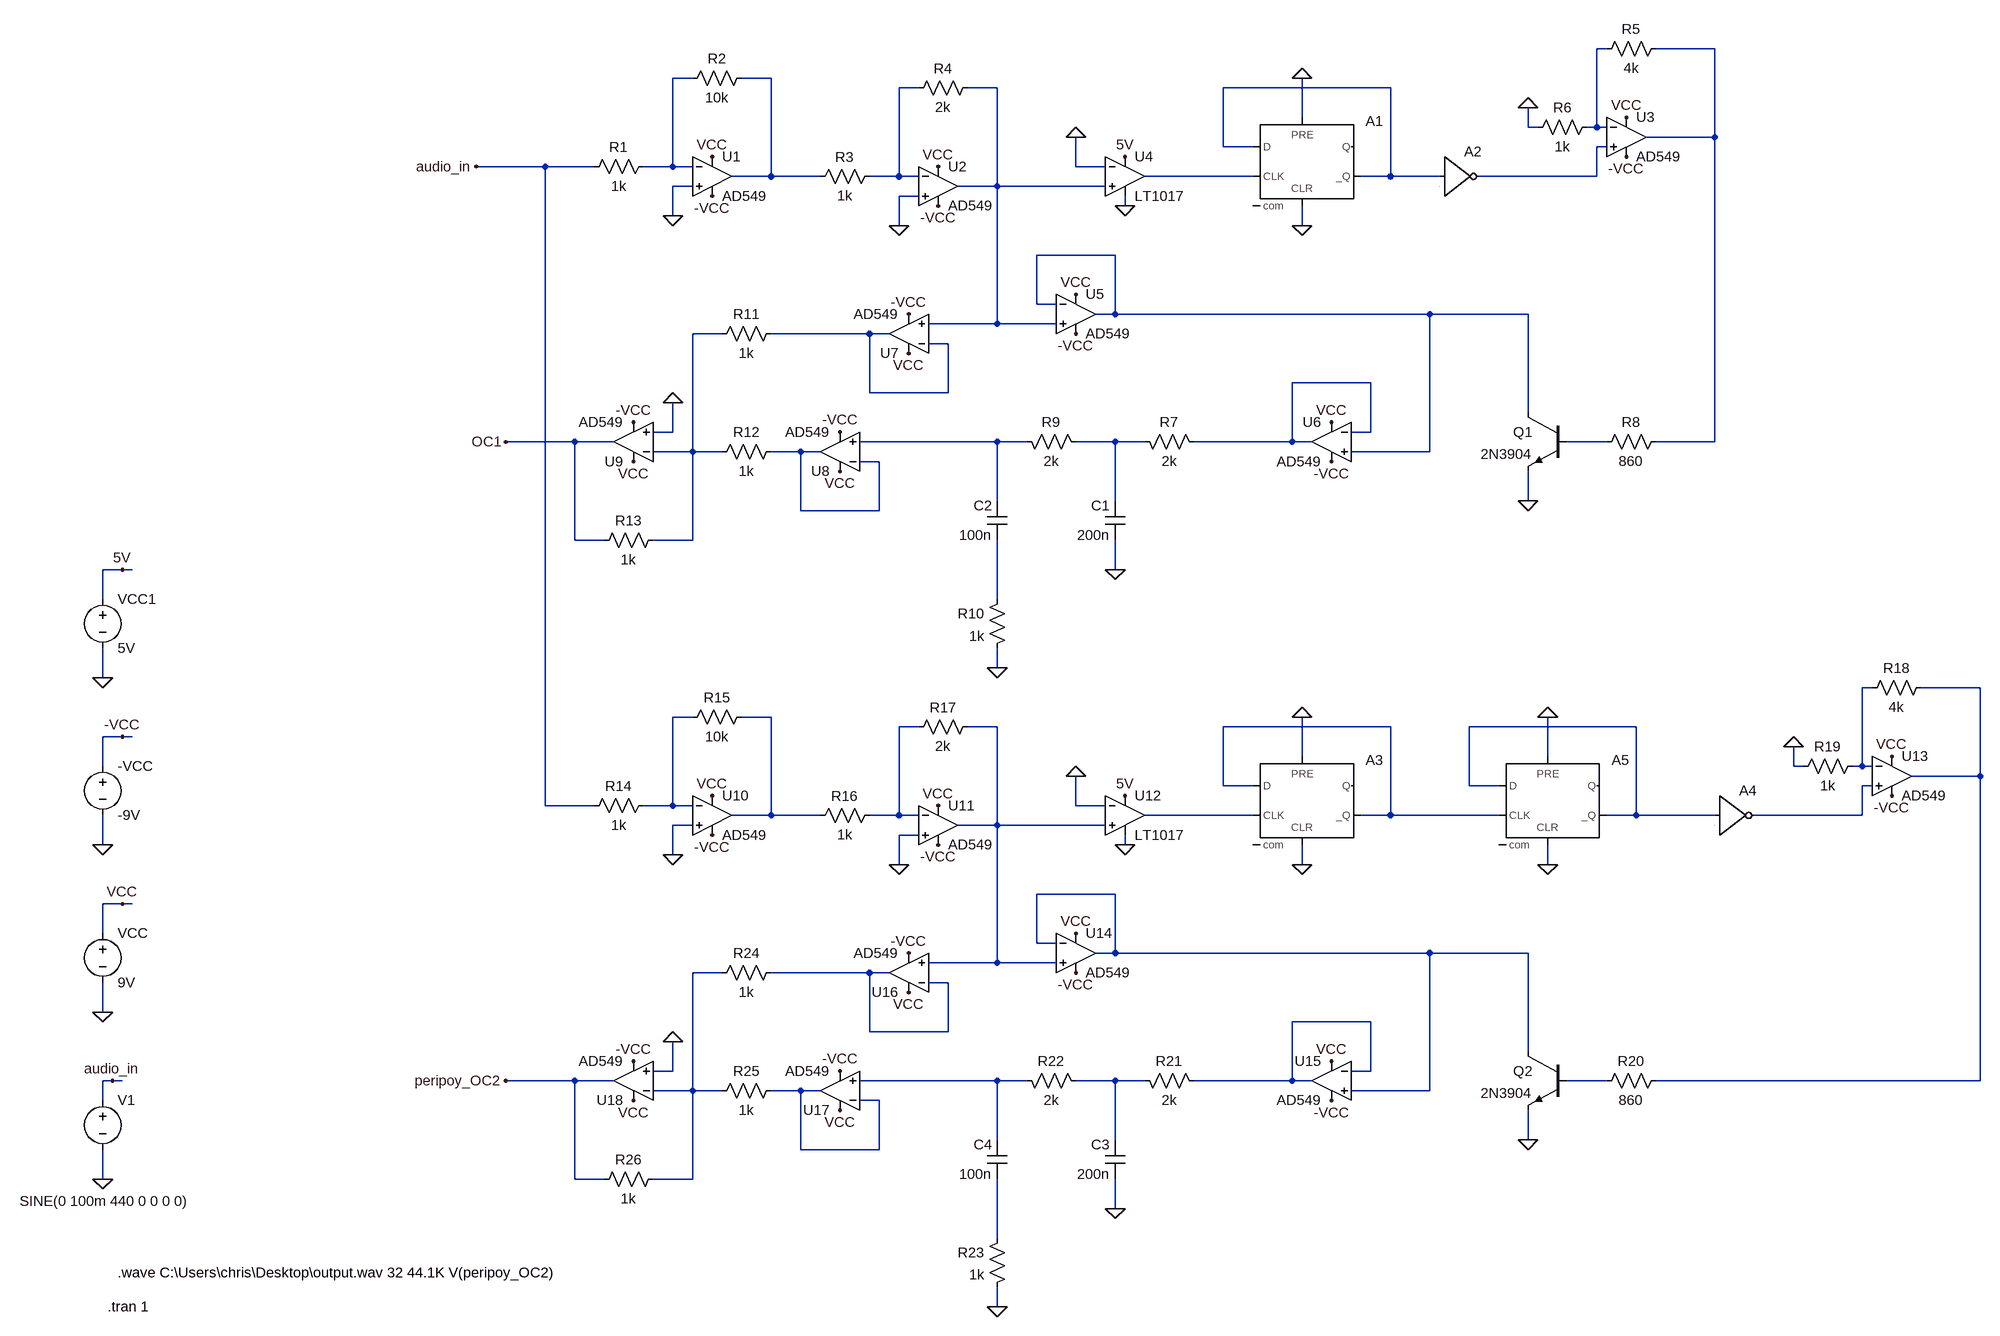
[diagram p0: schematic octaver.asc]
octaver.asc, the LTspice schematic file:
Version 4
SHEET 1 3124 1348
WIRE 2080 -720 2064 -720
WIRE 2256 -720 2160 -720
WIRE 592 -672 560 -672
WIRE 720 -672 672 -672
WIRE 960 -656 928 -656
WIRE 1088 -656 1040 -656
WIRE 1728 -656 1456 -656
WIRE 1584 -608 1584 -672
WIRE 1952 -592 1952 -624
WIRE 1968 -592 1952 -592
WIRE 2064 -592 2064 -720
WIRE 2064 -592 2048 -592
WIRE 2080 -592 2064 -592
WIRE 2256 -576 2256 -720
WIRE 2256 -576 2144 -576
WIRE 1456 -560 1456 -656
WIRE 1504 -560 1456 -560
WIRE 2080 -560 2064 -560
WIRE 352 -528 240 -528
WIRE 432 -528 352 -528
WIRE 560 -528 560 -672
WIRE 560 -528 512 -528
WIRE 592 -528 560 -528
WIRE 1216 -528 1216 -576
WIRE 1264 -528 1216 -528
WIRE 720 -512 720 -672
WIRE 720 -512 656 -512
WIRE 800 -512 720 -512
WIRE 928 -512 928 -656
WIRE 928 -512 880 -512
WIRE 960 -512 928 -512
WIRE 1504 -512 1328 -512
WIRE 1728 -512 1728 -656
WIRE 1728 -512 1680 -512
WIRE 1808 -512 1728 -512
WIRE 2064 -512 2064 -560
WIRE 2064 -512 1872 -512
WIRE 592 -496 560 -496
WIRE 1088 -496 1088 -656
WIRE 1088 -496 1024 -496
WIRE 1264 -496 1088 -496
WIRE 960 -480 928 -480
WIRE 1296 -464 1296 -480
WIRE 560 -448 560 -496
WIRE 928 -432 928 -480
WIRE 1584 -432 1584 -464
WIRE 1280 -384 1152 -384
WIRE 1152 -304 1152 -384
WIRE 1184 -304 1152 -304
WIRE 1280 -288 1280 -384
WIRE 1280 -288 1248 -288
WIRE 1792 -288 1280 -288
WIRE 1952 -288 1792 -288
WIRE 1088 -272 1088 -496
WIRE 1088 -272 976 -272
WIRE 1184 -272 1088 -272
WIRE 640 -256 592 -256
WIRE 880 -256 720 -256
WIRE 912 -256 880 -256
WIRE 1008 -240 976 -240
WIRE 1696 -176 1568 -176
WIRE 880 -160 880 -256
WIRE 1008 -160 1008 -240
WIRE 1008 -160 880 -160
WIRE 1952 -128 1952 -288
WIRE 560 -96 560 -144
WIRE 560 -96 528 -96
WIRE 1696 -96 1696 -176
WIRE 1696 -96 1664 -96
WIRE 400 -80 288 -80
WIRE 464 -80 400 -80
WIRE 1088 -80 864 -80
WIRE 1136 -80 1088 -80
WIRE 1280 -80 1216 -80
WIRE 1328 -80 1280 -80
WIRE 1568 -80 1568 -176
WIRE 1568 -80 1408 -80
WIRE 1600 -80 1568 -80
WIRE 2080 -80 2016 -80
WIRE 2256 -80 2256 -576
WIRE 2256 -80 2160 -80
WIRE 592 -64 592 -256
WIRE 592 -64 528 -64
WIRE 640 -64 592 -64
WIRE 768 -64 720 -64
WIRE 800 -64 768 -64
WIRE 1792 -64 1792 -288
WIRE 1792 -64 1664 -64
WIRE 896 -48 864 -48
WIRE 1088 16 1088 -80
WIRE 1280 16 1280 -80
WIRE 1952 16 1952 -32
WIRE 768 32 768 -64
WIRE 896 32 896 -48
WIRE 896 32 768 32
WIRE 400 80 400 -80
WIRE 448 80 400 80
WIRE 592 80 592 -64
WIRE 592 80 528 80
WIRE -336 128 -368 128
WIRE -320 128 -336 128
WIRE 1280 128 1280 80
WIRE -368 176 -368 128
WIRE 1088 176 1088 80
WIRE 1088 288 1088 256
WIRE -368 304 -368 256
WIRE 2512 320 2496 320
WIRE 2688 320 2592 320
WIRE 592 368 560 368
WIRE 720 368 672 368
WIRE 960 384 928 384
WIRE 1088 384 1040 384
WIRE 1728 384 1456 384
WIRE 2128 384 1856 384
WIRE -336 400 -368 400
WIRE -320 400 -336 400
WIRE 1584 432 1584 368
WIRE 1984 432 1984 368
WIRE -368 448 -368 400
WIRE 2384 448 2384 416
WIRE 2400 448 2384 448
WIRE 2496 448 2496 320
WIRE 2496 448 2480 448
WIRE 2512 448 2496 448
WIRE 2688 464 2688 320
WIRE 2688 464 2576 464
WIRE 1456 480 1456 384
WIRE 1504 480 1456 480
WIRE 1856 480 1856 384
WIRE 1904 480 1856 480
WIRE 2512 480 2496 480
WIRE 352 512 352 -528
WIRE 432 512 352 512
WIRE 560 512 560 368
WIRE 560 512 512 512
WIRE 592 512 560 512
WIRE 1216 512 1216 464
WIRE 1264 512 1216 512
WIRE 720 528 720 368
WIRE 720 528 656 528
WIRE 800 528 720 528
WIRE 928 528 928 384
WIRE 928 528 880 528
WIRE 960 528 928 528
WIRE 1504 528 1328 528
WIRE 1728 528 1728 384
WIRE 1728 528 1680 528
WIRE 1904 528 1728 528
WIRE 2128 528 2128 384
WIRE 2128 528 2080 528
WIRE 2256 528 2128 528
WIRE 2496 528 2496 480
WIRE 2496 528 2320 528
WIRE 592 544 560 544
WIRE 1088 544 1088 384
WIRE 1088 544 1024 544
WIRE 1264 544 1088 544
WIRE 960 560 928 560
WIRE -368 576 -368 528
WIRE 1296 576 1296 560
WIRE 560 592 560 544
WIRE 928 608 928 560
WIRE 1584 608 1584 576
WIRE 1984 608 1984 576
WIRE 1280 656 1152 656
WIRE -336 672 -368 672
WIRE -320 672 -336 672
WIRE -368 720 -368 672
WIRE 1152 736 1152 656
WIRE 1184 736 1152 736
WIRE 1280 752 1280 656
WIRE 1280 752 1248 752
WIRE 1792 752 1280 752
WIRE 1952 752 1792 752
WIRE 1088 768 1088 544
WIRE 1088 768 976 768
WIRE 1184 768 1088 768
WIRE 640 784 592 784
WIRE 880 784 720 784
WIRE 912 784 880 784
WIRE 1008 800 976 800
WIRE -368 848 -368 800
WIRE 1696 864 1568 864
WIRE 880 880 880 784
WIRE 1008 880 1008 800
WIRE 1008 880 880 880
WIRE 1952 912 1952 752
WIRE 560 944 560 896
WIRE 560 944 528 944
WIRE 1696 944 1696 864
WIRE 1696 944 1664 944
WIRE -352 960 -368 960
WIRE -336 960 -352 960
WIRE 400 960 288 960
WIRE 464 960 400 960
WIRE 1088 960 864 960
WIRE 1136 960 1088 960
WIRE 1280 960 1216 960
WIRE 1328 960 1280 960
WIRE 1568 960 1568 864
WIRE 1568 960 1408 960
WIRE 1600 960 1568 960
WIRE 2080 960 2016 960
WIRE 2688 960 2688 464
WIRE 2688 960 2160 960
WIRE 592 976 592 784
WIRE 592 976 528 976
WIRE 640 976 592 976
WIRE 768 976 720 976
WIRE 800 976 768 976
WIRE 1792 976 1792 752
WIRE 1792 976 1664 976
WIRE -368 992 -368 960
WIRE 896 992 864 992
WIRE 1088 1056 1088 960
WIRE 1280 1056 1280 960
WIRE 1952 1056 1952 1008
WIRE 768 1072 768 976
WIRE 896 1072 896 992
WIRE 896 1072 768 1072
WIRE -368 1120 -368 1072
WIRE 400 1120 400 960
WIRE 448 1120 400 1120
WIRE 592 1120 592 976
WIRE 592 1120 528 1120
WIRE 1280 1168 1280 1120
WIRE 1088 1216 1088 1120
WIRE 1088 1328 1088 1296
FLAG -368 1120 0
FLAG -352 960 audio_in
FLAG -368 848 0
FLAG -368 576 0
FLAG -336 672 VCC
FLAG -336 400 -VCC
FLAG 624 -544 VCC
FLAG 624 -480 -VCC
FLAG 560 -448 0
FLAG 240 -528 audio_in
FLAG 992 -528 VCC
FLAG 992 -464 -VCC
FLAG 928 -432 0
FLAG -368 304 0
FLAG -336 128 5V
FLAG 1296 -464 0
FLAG 1216 -576 0
FLAG 1296 -544 5V
FLAG 1584 -432 0
FLAG 1584 -672 0
FLAG 2112 -608 VCC
FLAG 2112 -544 -VCC
FLAG 1952 -624 0
FLAG 1216 -320 VCC
FLAG 1216 -256 -VCC
FLAG 1952 16 0
FLAG 1632 -112 VCC
FLAG 1632 -48 -VCC
FLAG 1280 128 0
FLAG 1088 288 0
FLAG 944 -224 VCC
FLAG 944 -288 -VCC
FLAG 832 -32 VCC
FLAG 832 -96 -VCC
FLAG 496 -48 VCC
FLAG 496 -112 -VCC
FLAG 560 -144 0
FLAG 288 -80 OC1
FLAG 992 512 VCC
FLAG 992 576 -VCC
FLAG 928 608 0
FLAG 1296 576 0
FLAG 1216 464 0
FLAG 1296 496 5V
FLAG 1584 608 0
FLAG 1584 368 0
FLAG 2544 432 VCC
FLAG 2544 496 -VCC
FLAG 2384 416 0
FLAG 1216 720 VCC
FLAG 1216 784 -VCC
FLAG 1952 1056 0
FLAG 1632 928 VCC
FLAG 1632 992 -VCC
FLAG 1280 1168 0
FLAG 1088 1328 0
FLAG 944 816 VCC
FLAG 944 752 -VCC
FLAG 832 1008 VCC
FLAG 832 944 -VCC
FLAG 496 992 VCC
FLAG 496 928 -VCC
FLAG 560 896 0
FLAG 288 960 peripoy_OC2
FLAG 624 496 VCC
FLAG 624 560 -VCC
FLAG 560 592 0
FLAG 1984 608 0
FLAG 1984 368 0
SYMBOL voltage -368 976 R0
WINDOW 3 146 180 Right 2
WINDOW 123 0 0 Left 0
WINDOW 39 0 0 Left 0
SYMATTR Value SINE(0 100m 440 0 0 0 0)
SYMATTR InstName V1
SYMBOL voltage -368 704 R0
WINDOW 123 0 0 Left 0
WINDOW 39 0 0 Left 0
SYMATTR InstName VCC
SYMATTR Value 9V
SYMBOL voltage -368 432 R0
WINDOW 123 0 0 Left 0
WINDOW 39 0 0 Left 0
SYMATTR InstName -VCC
SYMATTR Value -9V
SYMBOL OpAmps\\AD549 624 -576 R0
SYMATTR InstName U1
SYMBOL res 528 -544 R90
WINDOW 0 0 56 VBottom 2
WINDOW 3 32 56 VTop 2
SYMATTR InstName R1
SYMATTR Value 1k
SYMBOL res 688 -688 R90
WINDOW 0 0 56 VBottom 2
WINDOW 3 32 56 VTop 2
SYMATTR InstName R2
SYMATTR Value 10k
SYMBOL OpAmps\\AD549 992 -560 R0
SYMATTR InstName U2
SYMBOL res 896 -528 R90
WINDOW 0 0 56 VBottom 2
WINDOW 3 32 56 VTop 2
SYMATTR InstName R3
SYMATTR Value 1k
SYMBOL res 1056 -672 R90
WINDOW 0 0 56 VBottom 2
WINDOW 3 32 56 VTop 2
SYMATTR InstName R4
SYMATTR Value 2k
SYMBOL Comparators\\LT1017 1296 -512 R0
SYMATTR InstName U4
SYMBOL voltage -368 160 R0
WINDOW 123 0 0 Left 0
WINDOW 39 0 0 Left 0
SYMATTR InstName VCC1
SYMATTR Value 5V
SYMBOL Digital\\dflop 1584 -608 R0
SYMATTR InstName A1
SYMBOL OpAmps\\AD549 2112 -640 R0
SYMATTR InstName U3
SYMBOL res 2176 -736 R90
WINDOW 0 0 56 VBottom 2
WINDOW 3 32 56 VTop 2
SYMATTR InstName R5
SYMATTR Value 4k
SYMBOL res 2064 -608 R90
WINDOW 0 0 56 VBottom 2
WINDOW 3 32 56 VTop 2
SYMATTR InstName R6
SYMATTR Value 1k
SYMBOL Digital\\inv 1808 -576 R0
SYMATTR InstName A2
SYMBOL OpAmps\\AD549 1216 -352 R0
SYMATTR InstName U5
SYMBOL npn 2016 -128 M0
SYMATTR InstName Q1
SYMATTR Value 2N3904
SYMBOL res 2176 -96 R90
WINDOW 0 0 56 VBottom 2
WINDOW 3 32 56 VTop 2
SYMATTR InstName R8
SYMATTR Value 860
SYMBOL OpAmps\\AD549 1632 -144 M0
SYMATTR InstName U6
SYMBOL cap 1296 16 M0
SYMATTR InstName C1
SYMATTR Value 200n
SYMBOL res 1312 -96 M90
WINDOW 0 0 56 VBottom 2
WINDOW 3 32 56 VTop 2
SYMATTR InstName R7
SYMATTR Value 2k
SYMBOL cap 1104 16 M0
SYMATTR InstName C2
SYMATTR Value 100n
SYMBOL res 1120 -96 M90
WINDOW 0 0 56 VBottom 2
WINDOW 3 32 56 VTop 2
SYMATTR InstName R9
SYMATTR Value 2k
SYMBOL res 1104 160 M0
SYMATTR InstName R10
SYMATTR Value 1k
SYMBOL OpAmps\\AD549 944 -192 R180
SYMATTR InstName U7
SYMBOL OpAmps\\AD549 832 0 R180
SYMATTR InstName U8
SYMBOL res 736 -272 R90
WINDOW 0 0 56 VBottom 2
WINDOW 3 32 56 VTop 2
SYMATTR InstName R11
SYMATTR Value 1k
SYMBOL res 736 -80 R90
WINDOW 0 0 56 VBottom 2
WINDOW 3 32 56 VTop 2
SYMATTR InstName R12
SYMATTR Value 1k
SYMBOL OpAmps\\AD549 496 -16 R180
SYMATTR InstName U9
SYMBOL res 544 64 R90
WINDOW 0 0 56 VBottom 2
WINDOW 3 32 56 VTop 2
SYMATTR InstName R13
SYMATTR Value 1k
SYMBOL OpAmps\\AD549 992 480 R0
SYMATTR InstName U11
SYMBOL res 896 512 R90
WINDOW 0 0 56 VBottom 2
WINDOW 3 32 56 VTop 2
SYMATTR InstName R16
SYMATTR Value 1k
SYMBOL res 1056 368 R90
WINDOW 0 0 56 VBottom 2
WINDOW 3 32 56 VTop 2
SYMATTR InstName R17
SYMATTR Value 2k
SYMBOL Comparators\\LT1017 1296 528 R0
SYMATTR InstName U12
SYMBOL Digital\\dflop 1584 432 R0
SYMATTR InstName A3
SYMBOL OpAmps\\AD549 2544 400 R0
SYMATTR InstName U13
SYMBOL res 2608 304 R90
WINDOW 0 0 56 VBottom 2
WINDOW 3 32 56 VTop 2
SYMATTR InstName R18
SYMATTR Value 4k
SYMBOL res 2496 432 R90
WINDOW 0 0 56 VBottom 2
WINDOW 3 32 56 VTop 2
SYMATTR InstName R19
SYMATTR Value 1k
SYMBOL Digital\\inv 2256 464 R0
SYMATTR InstName A4
SYMBOL OpAmps\\AD549 1216 688 R0
SYMATTR InstName U14
SYMBOL npn 2016 912 M0
SYMATTR InstName Q2
SYMATTR Value 2N3904
SYMBOL res 2176 944 R90
WINDOW 0 0 56 VBottom 2
WINDOW 3 32 56 VTop 2
SYMATTR InstName R20
SYMATTR Value 860
SYMBOL OpAmps\\AD549 1632 896 M0
SYMATTR InstName U15
SYMBOL cap 1296 1056 M0
SYMATTR InstName C3
SYMATTR Value 200n
SYMBOL res 1312 944 M90
WINDOW 0 0 56 VBottom 2
WINDOW 3 32 56 VTop 2
SYMATTR InstName R21
SYMATTR Value 2k
SYMBOL cap 1104 1056 M0
SYMATTR InstName C4
SYMATTR Value 100n
SYMBOL res 1120 944 M90
WINDOW 0 0 56 VBottom 2
WINDOW 3 32 56 VTop 2
SYMATTR InstName R22
SYMATTR Value 2k
SYMBOL res 1104 1200 M0
SYMATTR InstName R23
SYMATTR Value 1k
SYMBOL OpAmps\\AD549 944 848 R180
SYMATTR InstName U16
SYMBOL OpAmps\\AD549 832 1040 R180
SYMATTR InstName U17
SYMBOL res 736 768 R90
WINDOW 0 0 56 VBottom 2
WINDOW 3 32 56 VTop 2
SYMATTR InstName R24
SYMATTR Value 1k
SYMBOL res 736 960 R90
WINDOW 0 0 56 VBottom 2
WINDOW 3 32 56 VTop 2
SYMATTR InstName R25
SYMATTR Value 1k
SYMBOL OpAmps\\AD549 496 1024 R180
SYMATTR InstName U18
SYMBOL res 544 1104 R90
WINDOW 0 0 56 VBottom 2
WINDOW 3 32 56 VTop 2
SYMATTR InstName R26
SYMATTR Value 1k
SYMBOL OpAmps\\AD549 624 464 R0
SYMATTR InstName U10
SYMBOL res 528 496 R90
WINDOW 0 0 56 VBottom 2
WINDOW 3 32 56 VTop 2
SYMATTR InstName R14
SYMATTR Value 1k
SYMBOL res 688 352 R90
WINDOW 0 0 56 VBottom 2
WINDOW 3 32 56 VTop 2
SYMATTR InstName R15
SYMATTR Value 10k
SYMBOL Digital\\dflop 1984 432 R0
SYMATTR InstName A5
TEXT -360 1328 Left 2 !.tran 1
TEXT -344 1272 Left 2 !.wave C:\\Users\\chris\\Desktop\\output.wav 32 44.1K V(peripoy_OC2)

The netlist it stands for:
* octaver.asc
V1 audio_in 0 SINE(0 100m 440 0 0 0 0)
VCC VCC 0 9V
V§-VCC -VCC 0 -9V
XU1 0 N003 VCC -VCC N004 AD549  ; pins In+ In- V+ V- OUT
R1 N003 audio_in 1k
R2 N004 N003 10k
XU2 0 N005 VCC -VCC N006 AD549  ; pins In+ In- V+ V- OUT
R3 N005 N004 1k
R4 N006 N005 2k
XU4 N006 0 5V 0 N009 LT1017  ; pins In+ In- V+ V- OUT
VCC1 5V 0 5V
A1 N007 0 N009 0 0 N007 0 0 DFLOP
XU3 N008 N001 VCC -VCC N002 AD549  ; pins In+ In- V+ V- OUT
R5 N002 N001 4k
R6 N001 0 1k
A2 N007 0 0 0 0 N008 0 0 BUF
XU5 N006 N010 VCC -VCC N010 AD549  ; pins In+ In- V+ V- OUT
Q1 N010 N016 0 0 2N3904
R8 N002 N016 860
XU6 N010 N013 VCC -VCC N013 AD549  ; pins In+ In- V+ V- OUT
C1 N015 0 200n
R7 N015 N013 2k
C2 N014 N018 100n
R9 N014 N015 2k
R10 N018 0 1k
XU7 N006 N012 VCC -VCC N012 AD549  ; pins In+ In- V+ V- OUT
XU8 N014 N017 VCC -VCC N017 AD549  ; pins In+ In- V+ V- OUT
R11 N012 N011 1k
R12 N017 N011 1k
XU9 0 N011 VCC -VCC OC1 AD549  ; pins In+ In- V+ V- OUT
R13 N011 OC1 1k
XU11 0 N023 VCC -VCC N024 AD549  ; pins In+ In- V+ V- OUT
R16 N023 N022 1k
R17 N024 N023 2k
XU12 N024 0 5V 0 N028 LT1017  ; pins In+ In- V+ V- OUT
A3 N025 0 N028 0 0 N025 0 0 DFLOP
XU13 N027 N019 VCC -VCC N020 AD549  ; pins In+ In- V+ V- OUT
R18 N020 N019 4k
R19 N019 0 1k
A4 N026 0 0 0 0 N027 0 0 BUF
XU14 N024 N029 VCC -VCC N029 AD549  ; pins In+ In- V+ V- OUT
Q2 N029 N035 0 0 2N3904
R20 N020 N035 860
XU15 N029 N032 VCC -VCC N032 AD549  ; pins In+ In- V+ V- OUT
C3 N034 0 200n
R21 N034 N032 2k
C4 N033 N037 100n
R22 N033 N034 2k
R23 N037 0 1k
XU16 N024 N031 VCC -VCC N031 AD549  ; pins In+ In- V+ V- OUT
XU17 N033 N036 VCC -VCC N036 AD549  ; pins In+ In- V+ V- OUT
R24 N031 N030 1k
R25 N036 N030 1k
XU18 0 N030 VCC -VCC peripoy_OC2 AD549  ; pins In+ In- V+ V- OUT
R26 N030 peripoy_OC2 1k
XU10 0 N021 VCC -VCC N022 AD549  ; pins In+ In- V+ V- OUT
R14 N021 audio_in 1k
R15 N022 N021 10k
A5 N026 0 N025 0 0 N026 0 0 DFLOP
.model NPN NPN
.model PNP PNP
.lib standard.bjt
.tran 1
.wave C:\Users\chris\Desktop\output.wav 32 44.1K V(peripoy_OC2)
.backanno
.end